# EAGLE design AND gate (EAGLE 6.1)
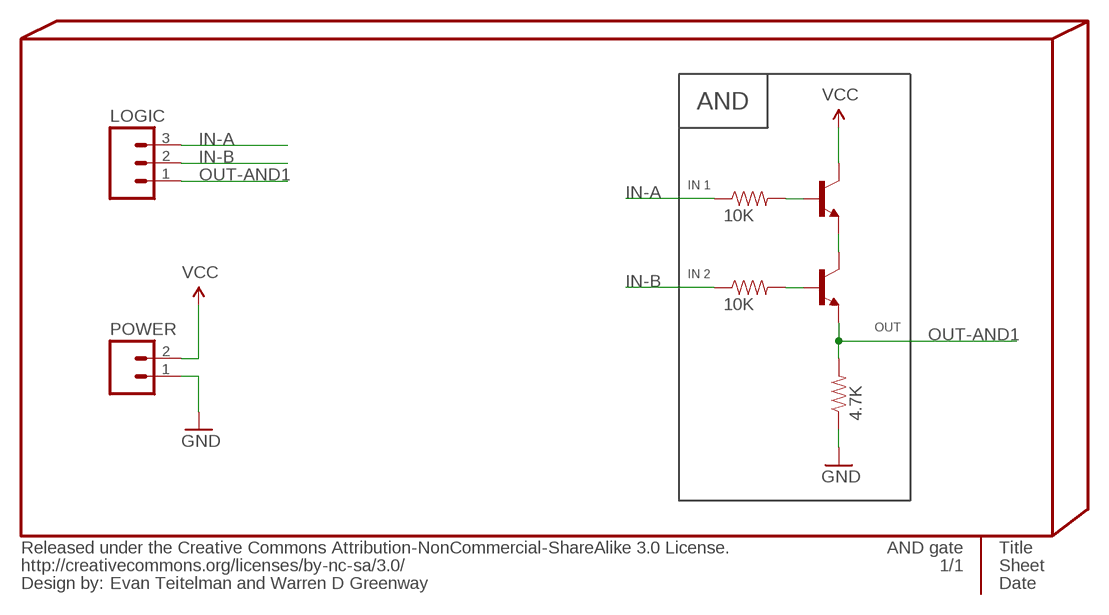
[diagram p0: schematic, sheet 1]

## Parts
INFO4  Evan Teitelman and Warren D Greenway  %CC-NC-SA  [%CC-NC-SA]
LOGIC  M03PTH  [1X03]
PDR-AND1  4.7K  RESISTOR0402-RES  [0402-RES]
POWER  M02PTH  [1X02]
Q1-AND1  TRANSISTOR_NPNSOT23  [SOT23]
Q2-AND1  TRANSISTOR_NPNSOT23  [SOT23]
R1-AND1  10K  RESISTOR0402-RES  [0402-RES]
R2-AND1  10K  RESISTOR0402-RES  [0402-RES]

## Nets
GND: PDR-AND1.1 POWER.1 ; supply symbol labelled @GND
IN-A: LOGIC.3 R1-AND1.1
IN-B: LOGIC.2 R2-AND1.1
N$3: Q1-AND1.1(B) R1-AND1.2
N$4: Q2-AND1.1(B) R2-AND1.2
OUT-AND1: LOGIC.1 PDR-AND1.2 Q2-AND1.2(E)
Q-Q-AND1: Q1-AND1.2(E) Q2-AND1.3(C)
VCC: POWER.2 Q1-AND1.3(C) ; supply symbol labelled @VCC

## Notes on the sheet
- AND
- IN 1
- IN 2
- OUT

## Library data of the parts
INFO4 = PygmyBoards:%CC-NC-SA: Released under the Creative Commons Attribution-NonCommercial-ShareAlike 3.0 License. http://creativecommons.org/licenses/by-sa/3.0 Design by: [Designer Name] Change this part's value to change the designer name
LOGIC = SparkFun:M03: Header 3 Standard 3-pin 0.1" header. Use with straight break away headers (SKU : PRT-00116), right angle break away headers (PRT-00553), swiss pins (PRT-00743), machine pins (PRT-00117), and female headers (PRT-00115). Molex polarized connector foot print use with SKU : PRT-08232 with associated crimp pins and housings.
PDR-AND1 R1-AND1 R2-AND1 = SparkFun:RESISTOR: Resistor Basic schematic elements and footprints for 0603, 1206, and PTH resistors.
POWER = SparkFun:M02: Header 2 Standard 2-pin 0.1" header. Use with straight break away headers (SKU : PRT-00116), right angle break away headers (PRT-00553), swiss pins (PRT-00743), machine pins (PRT-00117), and female headers (PRT-00115). Molex polarized connector foot print use with SKU : PRT-08233 with associated crimp pins and housings.
Q1-AND1 Q2-AND1 = SparkFun:TRANSISTOR_NPN: Transistor NPN BJT configuration in SOT23 package. MMBT2222 is the common NPN we use. Double check BCE configuration again layout.

## Board
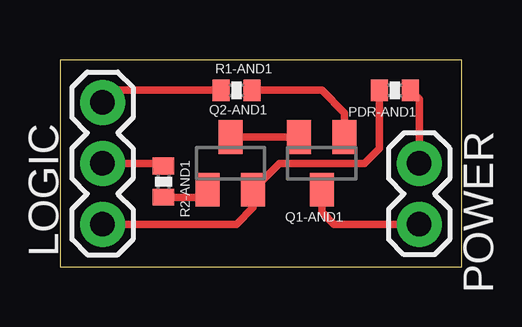
[diagram p1: board, top side]

Size 16.76 x 8.64 mm. Coordinates in mm from the lower left corner, seen from the top.
Outline: 0,0 16.76,0 16.76,8.64 0,8.64 0,0
Copper layers (1*16): Top 0.035mm / dielectric 1.5mm / Bottom 0.035mm
Design rules: minimum track width 6mil, minimum drill 13mil, track to track 6mil, track to pad 6mil, pad to pad 4mil, via to via 6mil, smd to smd 4mil, copper to edge 15mil, drill to drill 6mil, minimum pad ring 10mil, minimum via ring 8mil, stop-mask expansion 4mil, vias tented up to drill 25mil, thermal gap 10mil

### Footprints (pad centres in the part's own frame; a part is rotated, then mirrored left to right if it is on the bottom)
1X03 = drill 1.016 pad 1.88: 1 0,0; 2 2.54,0; 3 5.08,0
0402-RES = smd 0.7 x 0.9: 1 -0.65,0; 2 0.65,0
1X02 = drill 1.016 pad 1.88: 1 0,0; 2 2.54,0
SOT23 = smd 1 x 1.4: 1 -0.95,-1.1; 2 0.95,-1.1; 3 0,1.1

### Placement (x,y rotation side)
INFO4  0,-7.62 0 top  (outside the outline)
LOGIC  1.78,1.78 90 top
PDR-AND1  13.97,7.37 180 top
POWER  14.99,4.32 270 top
Q1-AND1  10.92,4.32 180 top
Q2-AND1  7.11,4.32 0 top
R1-AND1  7.37,7.37 0 top
R2-AND1  4.32,3.56 270 top

### Tracks (layer width: path | path; a pad name or v marks a point on that pad's centre or on a via)
GND
  Top 0.305: POWER.1 14.99,7 PDR-AND1.1
IN-A
  Top 0.305: R1-AND1.1 2.29,7.37 LOGIC.3
IN-B
  Top 0.305: R2-AND1.1 4.21,4.32 LOGIC.2
N$3
  Top 0.305: R1-AND1.2 10.92,7.37 11.87,6.42 Q1-AND1.1
N$4
  Top 0.305: Q2-AND1.1 5.85,2.91 R2-AND1.2
OUT-AND1
  Top 0.305: LOGIC.1 7.37,1.78 8.06,2.47 Q2-AND1.2 9.16,4.32 12.7,4.32 13.32,4.94 PDR-AND1.2
Q-Q-AND1
  Top 0.305: Q2-AND1.3 Q1-AND1.2
VCC
  Top 0.305: POWER.2 11.43,1.78 10.92,2.29 Q1-AND1.3

### Text on the board
_bsilk: AND | Out | In-B | Gnd | In-A | Vcc